# EAGLE design satellites_pcb_v2_0 (EAGLE 9.1.2)
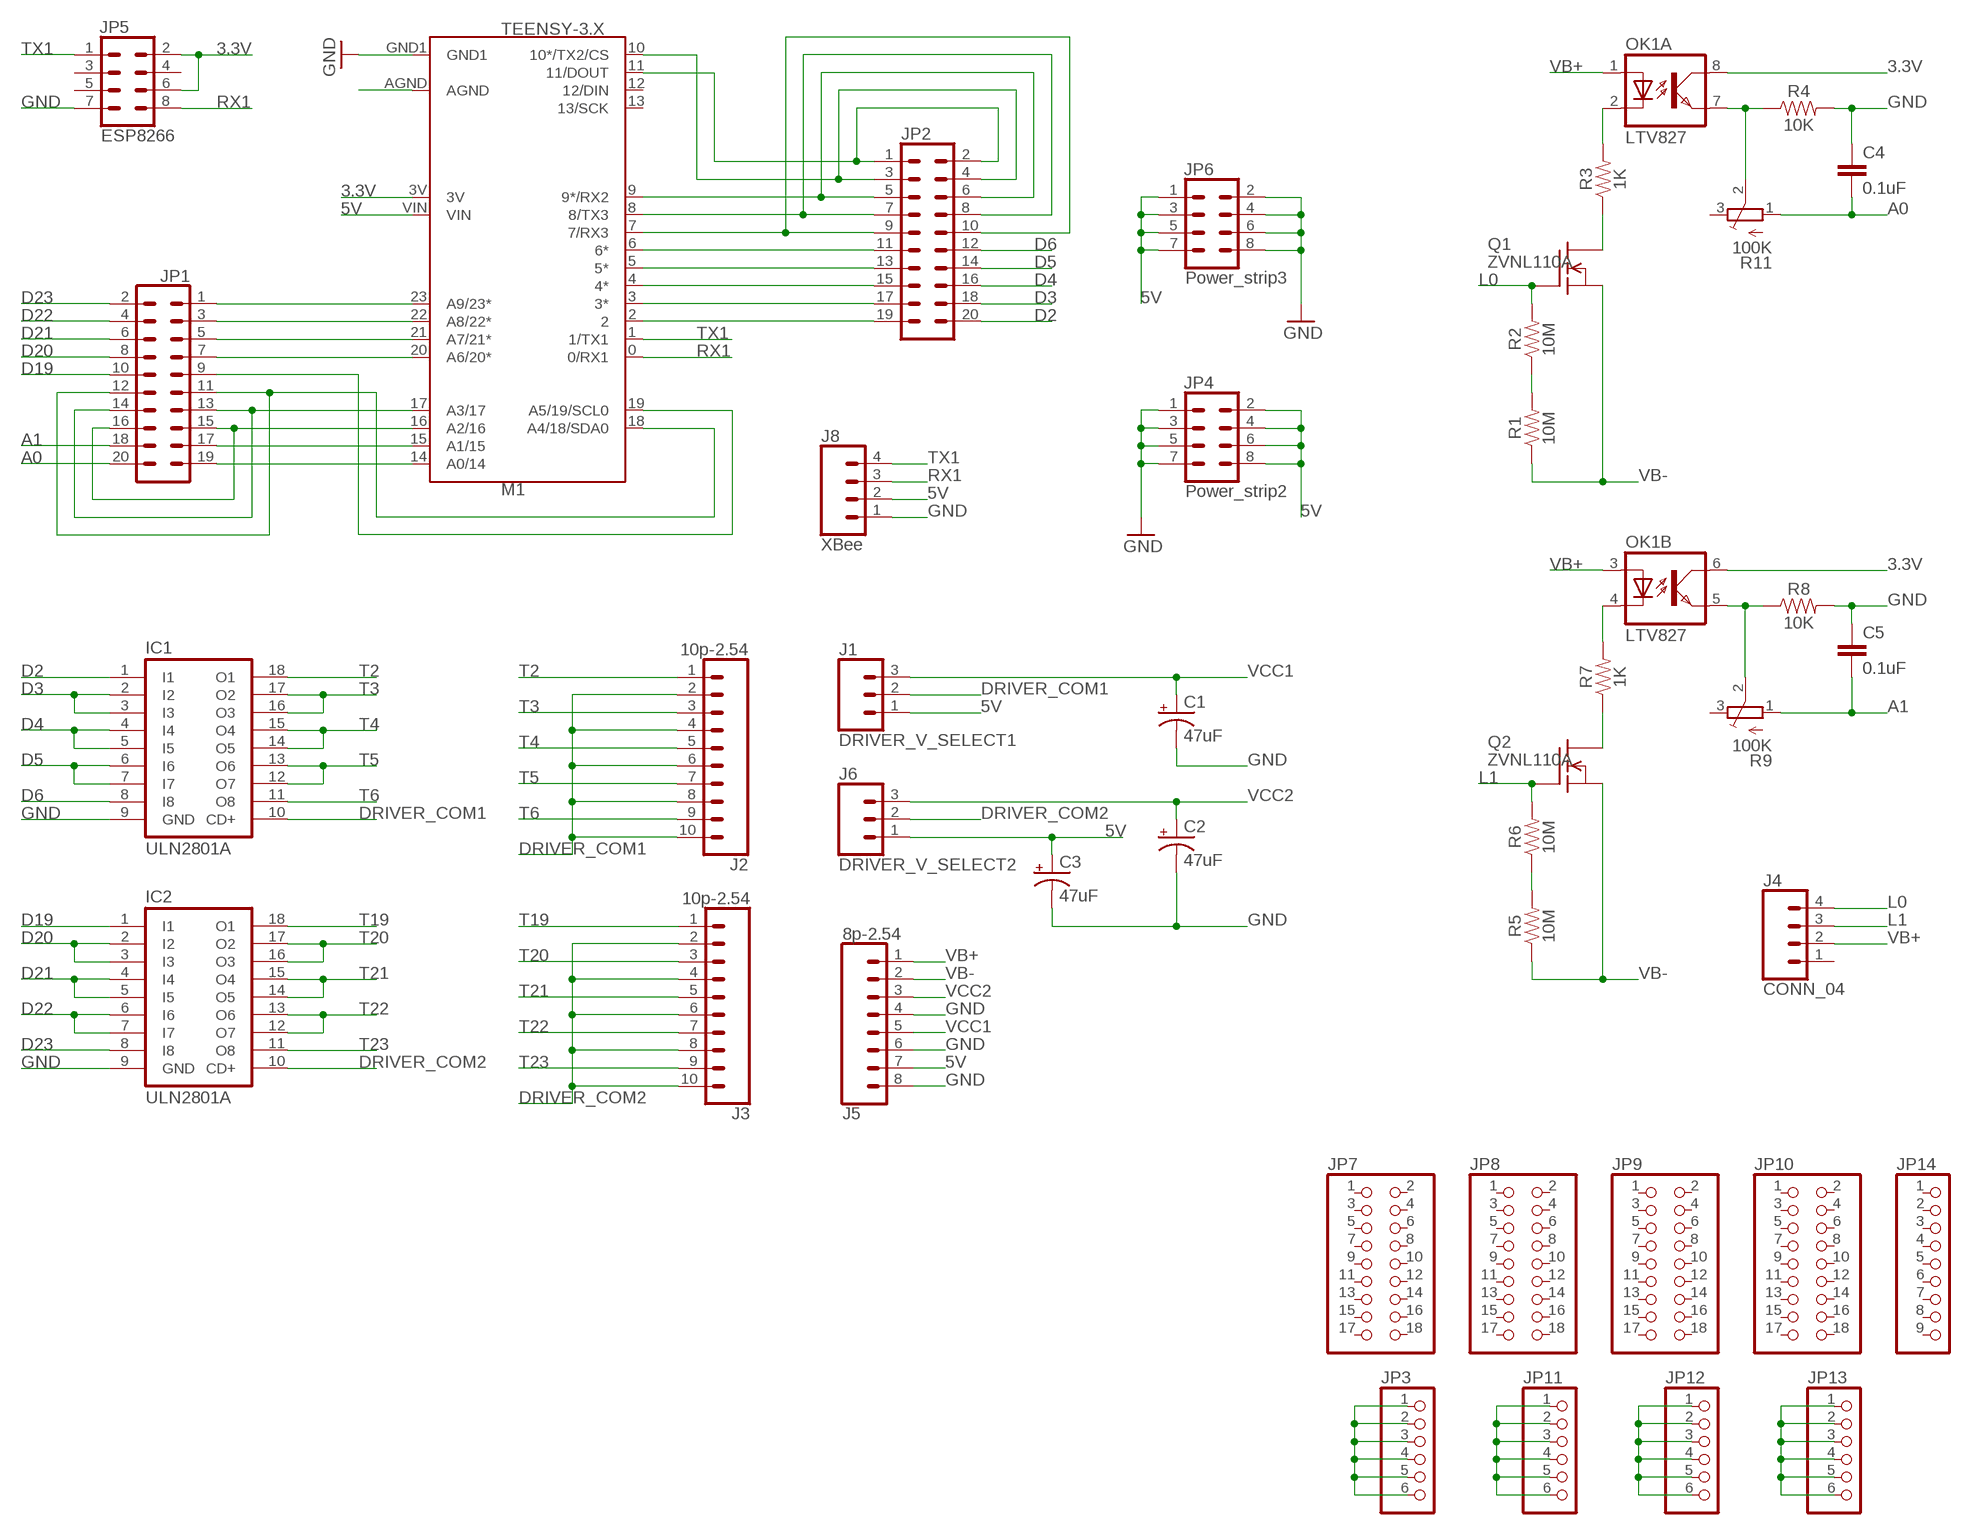
[diagram p0: schematic, sheet 1]

## Parts
C1  47uF  100UF-POLAR-RADIAL-2.5MM-25V-20%  [CPOL-RADIAL-2.5MM-6.5MM]
C2  47uF  100UF-POLAR-RADIAL-2.5MM-25V-20%  [CPOL-RADIAL-2.5MM-6.5MM]
C3  47uF  100UF-POLAR-RADIAL-2.5MM-25V-20%  [CPOL-RADIAL-2.5MM-6.5MM]
C4  0.1uF  22PF-PTH-2.54MM-200V-5%  [CAP-PTH-2.54]
C5  0.1uF  22PF-PTH-2.54MM-200V-5%  [CAP-PTH-2.54]
IC1  ULN2801A  [DIL18]
IC2  ULN2801A  [DIL18]
J1  DRIVER_V_SELECT1  CONN_03LOCK  [1X03_LOCK]
J2  10p-2.54  CONN_10  [SCREW_TERMINAL_10P_2.54MM_LONGPAD]
J3  10p-2.54  CONN_10  [SCREW_TERMINAL_10P_2.54MM_LONGPAD]
J4  CONN_04  [SCREW_TERMINAL_4P_2.54MM]
J5  8p-2.54  CONN_08SCREW_TERMINAL_8P_2.54MM_LONGPAD  [SCREW_TERMINAL_8P_2.54MM_LONGPAD]
J6  DRIVER_V_SELECT2  CONN_03LOCK  [1X03_LOCK]
J8  XBee  CONN_04LOCK  [1X04_LOCK]
JP1  CONN_10X2  [2X10]
JP2  CONN_10X2  [2X10]
JP3  PINHD-1X6CLEAN  [1X06-CLEAN]
JP4  Power_strip2  CONN_04X2  [2X4]
JP5  ESP8266  CONN_04X2  [2X4]
JP6  Power_strip3  CONN_04X2  [2X4]
JP7  PINHD-2X9-CBIG  [2X09-CLEANBIG]
JP8  PINHD-2X9-CBIG  [2X09-CLEANBIG]
JP9  PINHD-2X9-CBIG  [2X09-CLEANBIG]
JP10  PINHD-2X9-CBIG  [2X09-CLEANBIG]
JP11  PINHD-1X6CLEAN  [1X06-CLEAN]
JP12  PINHD-1X6CLEAN  [1X06-CLEAN]
JP13  PINHD-1X6CLEAN  [1X06-CLEAN]
JP14  PINHD-1X9  [1X09-BIG]
M1  TEENSY-3.X  TEENSY-3.1-TWO_ROWSNOSILK  [TEENSY-3.1_NOSILK]
OK1  LTV827  [DIP08]
Q1  ZVNL110A  [TO92]
Q2  ZVNL110A  [TO92]
R1  10M  RESISTORAXIAL-0.3  [AXIAL-0.3]
R2  10M  RESISTORAXIAL-0.3  [AXIAL-0.3]
R3  1K  RESISTORAXIAL-0.3  [AXIAL-0.3]
R4  10K  RESISTORAXIAL-0.3  [AXIAL-0.3]
R5  10M  RESISTORAXIAL-0.3  [AXIAL-0.3]
R6  10M  RESISTORAXIAL-0.3  [AXIAL-0.3]
R7  1K  RESISTORAXIAL-0.3  [AXIAL-0.3]
R8  10K  RESISTORAXIAL-0.3  [AXIAL-0.3]
R9  100K  TRIMPOT3386H  [TRIM-3386H]
R11  100K  TRIMPOT3386H  [TRIM-3386H]

## Nets
3.3V: JP5.2 JP5.6 M1.3V OK1.6(B:COL) OK1.8(A:COL)
5V [supply]: C3.1(+) J1.1 J5.7 J6.1 J8.2 JP4.2 JP4.4 JP4.6 JP4.8 JP6.1 JP6.3 JP6.5 JP6.7 M1.VIN
A0: C4.2 JP1.20 R11.1(A)
A1: C5.2 JP1.18 R9.1(A)
D2: IC1.1(I1) JP2.20
D3: IC1.2(I2) IC1.3(I3) JP2.18
D4: IC1.4(I4) IC1.5(I5) JP2.16
D5: IC1.6(I6) IC1.7(I7) JP2.14
D6: IC1.8(I8) JP2.12
D19: IC2.1(I1) JP1.10
D20: IC2.2(I2) IC2.3(I3) JP1.8
D21: IC2.4(I4) IC2.5(I5) JP1.6
D22: IC2.6(I6) IC2.7(I7) JP1.4
D23: IC2.8(I8) JP1.2
DRIVER_COM1 [supply]: IC1.10(CD+) J1.2 J2.2 J2.4 J2.6 J2.8 J2.10
DRIVER_COM2 [supply]: IC2.10(CD+) J3.2 J3.4 J3.6 J3.8 J3.10 J6.2
GND [supply]: C1.2(-) C2.2(-) C3.2(-) C4.1 C5.1 IC1.9(GND) IC2.9(GND) J5.4 J5.6 J5.8 J8.1 JP4.1 JP4.3 JP4.5 JP4.7 JP5.7 JP6.2 JP6.4 JP6.6 JP6.8 M1.GND1 R4.P$2 R8.P$2
L0: J4.4 Q1.2(G) R2.P$2
L1: J4.3 Q2.2(G) R6.P$2
N$1: JP1.1 M1.23(A9/23*)
N$2: JP1.3 M1.22(A8/22*)
N$3: JP2.5 JP2.6 M1.9(9*/RX2)
N$4: JP2.7 JP2.8 M1.8(8/TX3)
N$5: OK1.7(A:EMIT) R4.P$1 R11.2(S)
N$6: JP2.11 M1.6(6*)
N$7: JP2.13 M1.5(5*)
N$8: JP2.3 JP2.4 M1.10(10*/TX2/CS)
N$9: JP2.15 M1.4(4*)
N$10: JP1.5 M1.21(A7/21*)
N$11: JP1.7 M1.20(A6/20*)
N$12: OK1.5(B:EMIT) R8.P$1 R9.2(S)
N$13: Q1.1(D) R3.P$1
N$14: JP2.17 M1.3(3*)
N$15: R1.P$2 R2.P$1
N$16: JP2.19 M1.2
N$17: JP1.15 JP1.16 M1.16(A2/16)
N$18: JP1.17 M1.15(A1/15)
N$19: JP1.19 M1.14(A0/14)
N$20: JP1.11 JP1.12 M1.18(A4/18/SDA0)
N$21: JP1.9 M1.19(A5/19/SCL0)
N$22: OK1.2(A:C) R3.P$2
N$23: R5.P$2 R6.P$1
N$24: Q2.1(D) R7.P$1
N$25: OK1.4(B:C) R7.P$2
N$26 [supply]: JP3.1 JP3.2 JP3.3 JP3.4 JP3.5 JP3.6
N$27 [supply]: JP11.1 JP11.2 JP11.3 JP11.4 JP11.5 JP11.6
N$28 [supply]: JP12.1 JP12.2 JP12.3 JP12.4 JP12.5 JP12.6
N$29: JP2.9 JP2.10 M1.7(7/RX3)
N$30 [supply]: JP13.1 JP13.2 JP13.3 JP13.4 JP13.5 JP13.6
N$31: M1.AGND
N$32: JP1.13 JP1.14 M1.17(A3/17)
N$33: JP2.1 JP2.2 M1.11(11/DOUT)
RX1: J8.3 JP5.8 M1.0(0/RX1)
T2 [supply]: IC1.18(O1) J2.1
T3 [supply]: IC1.16(O3) IC1.17(O2) J2.3
T4 [supply]: IC1.14(O5) IC1.15(O4) J2.5
T5 [supply]: IC1.12(O7) IC1.13(O6) J2.7
T6 [supply]: IC1.11(O8) J2.9
T19 [supply]: IC2.18(O1) J3.1
T20 [supply]: IC2.16(O3) IC2.17(O2) J3.3
T21 [supply]: IC2.14(O5) IC2.15(O4) J3.5
T22 [supply]: IC2.12(O7) IC2.13(O6) J3.7
T23 [supply]: IC2.11(O8) J3.9
TX1: J8.4 JP5.1 M1.1(1/TX1)
VB+: J4.2 J5.1 OK1.1(A:A) OK1.3(B:A)
VB-: J5.2 Q1.3(S) Q2.3(S) R1.P$1 R5.P$1
VCC1 [supply]: C1.1(+) J1.3 J5.5
VCC2 [supply]: C2.1(+) J5.3 J6.3
Unconnected: J4.1 JP5.3 JP5.4 JP5.5 JP7.1 JP7.2 JP7.3 JP7.4 JP7.5 JP7.6 JP7.7 JP7.8 JP7.9 JP7.10 JP7.11 JP7.12 JP7.13 JP7.14 JP7.15 JP7.16 JP7.17 JP7.18 JP8.1 JP8.2 JP8.3 JP8.4 JP8.5 JP8.6 JP8.7 JP8.8 JP8.9 JP8.10 JP8.11 JP8.12 JP8.13 JP8.14 JP8.15 JP8.16 JP8.17 JP8.18 JP9.1 JP9.2 JP9.3 JP9.4 JP9.5 JP9.6 JP9.7 JP9.8 JP9.9 JP9.10 JP9.11 JP9.12 JP9.13 JP9.14 JP9.15 JP9.16 JP9.17 JP9.18 JP10.1 JP10.2 JP10.3 JP10.4 JP10.5 JP10.6 JP10.7 JP10.8 JP10.9 JP10.10 JP10.11 JP10.12 JP10.13 JP10.14 JP10.15 JP10.16 JP10.17 JP10.18 JP14.1 JP14.2 JP14.3 JP14.4 JP14.5 JP14.6 JP14.7 JP14.8 JP14.9 M1.12(12/DIN) M1.13(13/SCK) R9.3(E) R11.3(E)

## Library data of the parts
C1-C3 = SparkFun-Capacitors:100UF-POLAR: 100µF polarized capacitors A capacitor is a passive two-terminal electrical component used to store electrical energy temporarily in an electric field.; PROD_ID: CAP-08439; VALUE: 100uF
C4 C5 = SparkFun-Capacitors:22PF: 22pF ceramic capacitors A capacitor is a passive two-terminal electrical component used to store electrical energy temporarily in an electric field.; PROD_ID: CAP-09128; VALUE: 22pF
IC1 IC2 = uln-udn:ULN2801A: DRIVER ARRAY
J1 J6 = SparkFun-Connectors:CONN_03: Multi connection point. Often used as Generic Header-pin footprint for 0.1 inch spaced/style header connections On any of the 0.1 inch spaced packages, you can populate with these: Break Away Headers - Straight <https://www.sparkfun.com/products/116> (PRT-00116) Break Away Male Headers - Right Angle <https://www.sparkfun.com/products/553> (PRT-00553) Female Headers <https://www.sparkfun.com/products/115> (PRT-00115) Break Away Headers - Machine Pin <https://www.sparkfun.com/products/117> (PRT-00117) Break Away Female Headers - Swiss Machine Pin <https://www.sparkfun.com/products/743> (PRT-00743) Stackable Header - 3 Pin (Female, 0.1") <https://www.sparkfun.com/products/13875> (PRT-13875) For SCREWTERMINALS and SPRING TERMINALS visit here: Screw Terimnals on SparkFun.com <https://www.sparkfun.com/search/results?term=Screw+Terminals> (5mm/3.5mm/2.54mm spacing) This device is also useful as a general connection point to wire up your design to another part of your project. Our various solder wires solder well into these plated through hole pads. Hook-Up Wire - Assortment (Stranded, 22 AWG) <https://www.sparkfun.com/products/11375> (PRT-11375) Hook-Up Wire - Assortment (Solid Core, 22 AWG) <https://www.sparkfun.com/products/11367> (PRT-11367) View the entire wire category on our website here <https://www.sparkfun.com/categories/141> Special notes: Molex polarized connector foot print use with SKU : PRT-08232 with associated crimp pins and housings.
J2 J3 = ManyDev:CONN_10
J4 = ManyDev:CONN_04
J5 = ManyDev:CONN_08
J8 = SparkFun-Connectors:CONN_04: Multi connection point. Often used as Generic Header-pin footprint for 0.1 inch spaced/style header connections On any of the 0.1 inch spaced packages, you can populate with these: Break Away Headers - Straight <https://www.sparkfun.com/products/116> (PRT-00116) Break Away Male Headers - Right Angle <https://www.sparkfun.com/products/553> (PRT-00553) Female Headers <https://www.sparkfun.com/products/115> (PRT-00115) Break Away Headers - Machine Pin <https://www.sparkfun.com/products/117> (PRT-00117) Break Away Female Headers - Swiss Machine Pin <https://www.sparkfun.com/products/743> (PRT-00743) For SCREWTERMINALS and SPRING TERMINALS visit here: Screw Terimnals on SparkFun.com <https://www.sparkfun.com/search/results?term=Screw+Terminals> (5mm/3.5mm/2.54mm spacing) This device is also useful as a general connection point to wire up your design to another part of your project. Our various solder wires solder well into these plated through hole pads. Hook-Up Wire - Assortment (Stranded, 22 AWG) <https://www.sparkfun.com/products/11375> (PRT-11375) Hook-Up Wire - Assortment (Solid Core, 22 AWG) <https://www.sparkfun.com/products/11367> (PRT-11367) View the entire wire category on our website here <https://www.sparkfun.com/categories/141> Special notes: Molex polarized connector foot print use with SKU : PRT-08231 with associated crimp pins and housings. 1MM SMD Version SKU: PRT-10208; PROD_ID: CONN-09696
JP1 JP2 = SparkFun-Connectors:CONN_10X2: Multi connection point. Often used as Generic Header-pin footprint for 0.1 inch spaced/style header connections On any of the 0.1 inch spaced packages, you can populate with these: Break Away Headers - Straight <https://www.sparkfun.com/products/116> (PRT-00116) Break Away Male Headers - Right Angle <https://www.sparkfun.com/products/553> (PRT-00553) Female Headers <https://www.sparkfun.com/products/115> (PRT-00115) Break Away Headers - Machine Pin <https://www.sparkfun.com/products/117> (PRT-00117) Break Away Female Headers - Swiss Machine Pin <https://www.sparkfun.com/products/743> (PRT-00743) Special note about the "SPECIAL" package: This was SPECIALLY designed to be used with our Graphic LCD Backpack. Be sure you want to use this! It is not only staggered on each line of header holes, but IT IS ALSO offset of the center point of the top and bottom lines by 5 mil. This causes the headers to lock into place on the "standard" footprint on the LCD screen. The extra squares on the tdocu layer are there simply to reference other pins (if you were to actually populate a longer header than ten long - this is what we do with the backpacks).
JP3 JP11-JP13 = adafruit:PINHD-1X6: PIN HEADER
JP4-JP6 = SparkFun-Connectors:CONN_04X2: Multi connection point. Often used as Generic Header-pin footprint for 0.1 inch spaced/style header connections On any of the 0.1 inch spaced packages, you can populate with these: Break Away Headers - Straight <https://www.sparkfun.com/products/116> (PRT-00116) Break Away Male Headers - Right Angle <https://www.sparkfun.com/products/553> (PRT-00553) Female Headers <https://www.sparkfun.com/products/115> (PRT-00115) Break Away Headers - Machine Pin <https://www.sparkfun.com/products/117> (PRT-00117) Break Away Female Headers - Swiss Machine Pin <https://www.sparkfun.com/products/743> (PRT-00743)
JP7-JP10 = adafruit:PINHD-2X9: PIN HEADER With larger annulars
JP14 = ManyDev:PINHD-1X9: Pin header 1x10 0.1" spacing With round pins
M1 = ManyDev:TEENSY-3.1-TWO_ROWS: Teensy 3+ Footprint Mechanical footprint with connectors for Teensy Development Board with ARM Cortex. SparkFun Products: Teensy 3.2 <https://www.sparkfun.com/products/13736> Teensy LC <https://www.sparkfun.com/products/13305>; SF_ID: DEV-12646
OK1 = ManyDev:LTV827: SHARP OPTO COUPLER
Q1 Q2 = ManyDev:ZVNL110A: N-Channel Enhancement MOSFET not checked
R1-R8 = SparkFun-Resistors:RESISTOR: Generic Resistor Package
R9 R11 = ManyDev:TRIMPOT: SMT trimmer potentiometer part number TC33X http://www.ladyada.net/library/eagle

## Net classes
0 default: width 0.254 mm, clearance 0.254 mm
1 supply: width 0.508 mm, clearance 0.508 mm

## Board
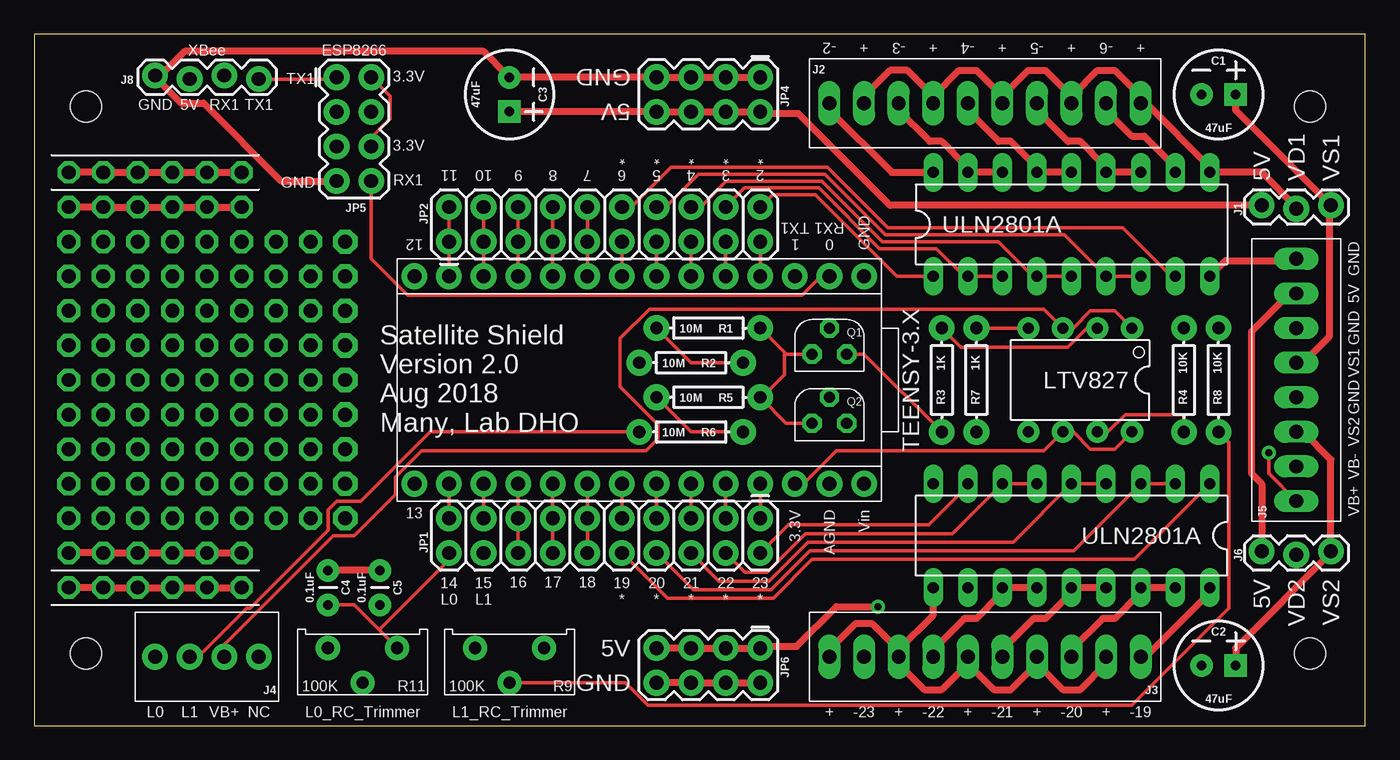
[diagram p1: board, top side]
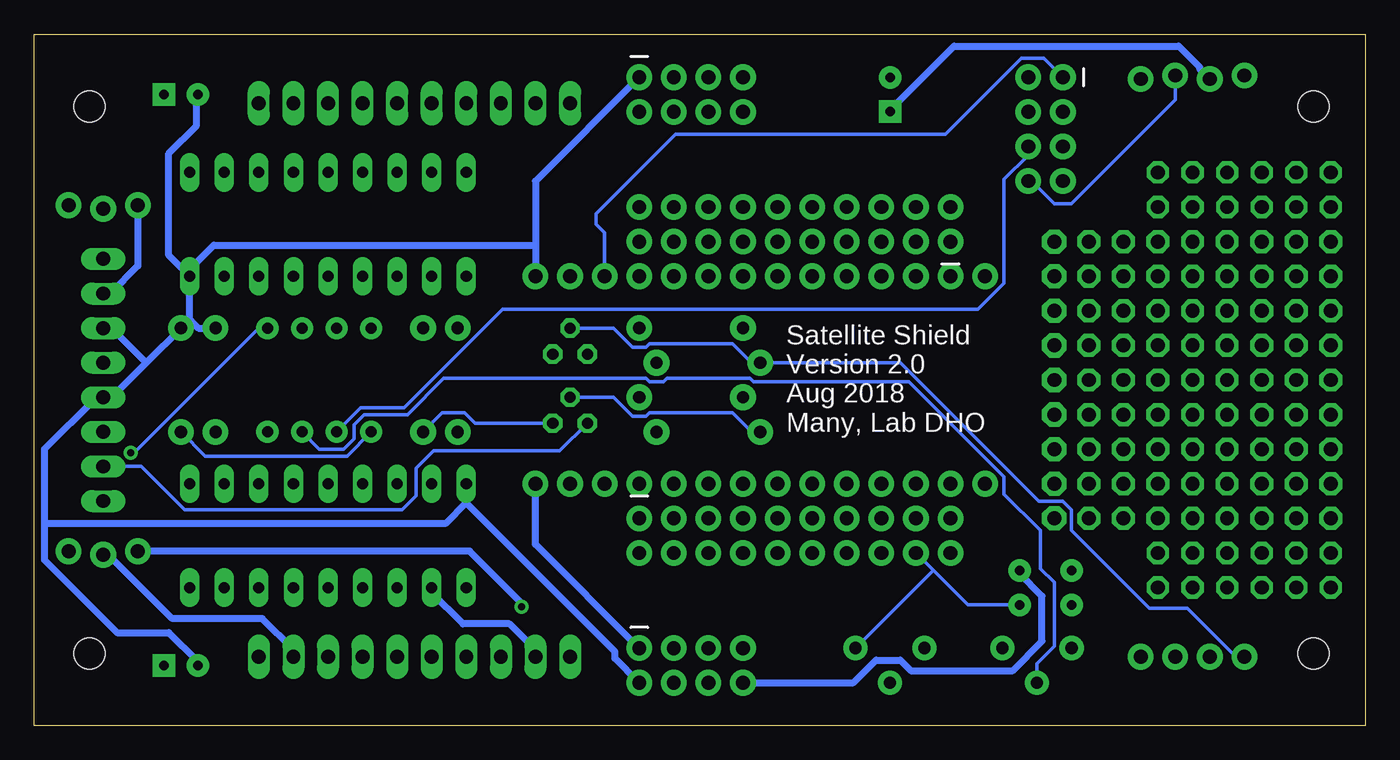
[diagram p2: board, bottom side, seen from below]

Size 97.79 x 50.8 mm. Coordinates in mm from the lower left corner, seen from the top.
Outline: 0,0 97.79,0 97.79,50.8 0,50.8 0,0
Copper layers (1*16): Top 0.035mm / dielectric 1.5mm / Bottom 0.035mm
Design rules "SparkFun": minimum track width 8mil, minimum drill 20mil, track to track 8mil, track to pad 8mil, pad to pad 8mil, via to via 8mil, smd to smd 8mil, copper to edge 10mil, drill to drill 8mil, minimum pad ring 12mil, minimum via ring 10mil, stop-mask expansion 4mil, vias tented up to drill 25mil, thermal gap 10mil
Holes 2.29 mm at 93.73,5.33 93.73,45.47 3.81,45.47 3.81,5.33

### Footprints (pad centres in the part's own frame; a part is rotated, then mirrored left to right if it is on the bottom)
CPOL-RADIAL-2.5MM-6.5MM = drill 0.7 pad 1.651 square: 1 1.25,0 | drill 0.7 pad 1.651: 2 -1.25,0
CAP-PTH-2.54 = drill 0.7 pad 1.651: 1 -1.27,0; 2 1.27,0
DIL18 = drill 0.813 long: 1 -10.16,-3.81; 2 -7.62,-3.81; 3 -5.08,-3.81; 4 -2.54,-3.81; 5 0,-3.81; 6 2.54,-3.81; 7 5.08,-3.81; 8 7.62,-3.81; 9 10.16,-3.81; 10 10.16,3.81; 11 7.62,3.81; 12 5.08,3.81; 13 2.54,3.81; 14 0,3.81; 15 -2.54,3.81; 16 -5.08,3.81; 17 -7.62,3.81; 18 -10.16,3.81
1X03_LOCK = drill 1.016 pad 1.88: 1 0,0.127; 2 2.54,-0.127; 3 5.08,0.127
SCREW_TERMINAL_10P_2.54MM_LONGPAD = drill 1.016 long: 1 0,0; 2 2.54,0; 3 5.08,0; 4 7.62,0; 5 10.16,0; 6 12.7,0; 7 15.24,0; 8 17.78,0; 9 20.32,0; 10 22.86,0
SCREW_TERMINAL_4P_2.54MM = drill 1.016 pad 1.88: 1 0,0; 2 2.54,0; 3 5.08,0; 4 7.62,0
SCREW_TERMINAL_8P_2.54MM_LONGPAD = drill 1.016 long: 1 0,0; 2 2.54,0; 3 5.08,0; 4 7.62,0; 5 10.16,0; 6 12.7,0; 7 15.24,0; 8 17.78,0
1X04_LOCK = drill 1.016 pad 1.88: 1 0,0.127; 2 2.54,-0.127; 3 5.08,0.127; 4 7.62,-0.127
2X10 = drill 1.016 pad 1.88: 1 0,0; 2 0,2.54; 3 2.54,0; 4 2.54,2.54; 5 5.08,0; 6 5.08,2.54; 7 7.62,0; 8 7.62,2.54; 9 10.16,0; 10 10.16,2.54; 11 12.7,0; 12 12.7,2.54; 13 15.24,0; 14 15.24,2.54; 15 17.78,0; 16 17.78,2.54; 17 20.32,0; 18 20.32,2.54; 19 22.86,0; 20 22.86,2.54
1X06-CLEAN = drill 1.016 octagon: 1 -6.35,0; 2 -3.81,0; 3 -1.27,0; 4 1.27,0; 5 3.81,0; 6 6.35,0
2X4 = drill 1.016 pad 1.88: 1 -3.81,-1.27; 2 -3.81,1.27; 3 -1.27,-1.27; 4 -1.27,1.27; 5 1.27,-1.27; 6 1.27,1.27; 7 3.81,-1.27; 8 3.81,1.27
2X09-CLEANBIG = drill 1.016 pad 1.676 octagon: 1 -10.16,-1.27; 2 -10.16,1.27; 3 -7.62,-1.27; 4 -7.62,1.27; 5 -5.08,-1.27; 6 -5.08,1.27; 7 -2.54,-1.27; 8 -2.54,1.27; 9 0,-1.27; 10 0,1.27; 11 2.54,-1.27; 12 2.54,1.27; 13 5.08,-1.27; 14 5.08,1.27; 15 7.62,-1.27; 16 7.62,1.27; 17 10.16,-1.27; 18 10.16,1.27
1X09-BIG = drill 1.016 pad 1.778 octagon: 1 -10.16,0; 2 -7.62,0; 3 -5.08,0; 4 -2.54,0; 5 0,0; 6 2.54,0; 7 5.08,0; 8 7.62,0; 9 10.16,0
TEENSY-3.1_NOSILK = drill 1.016 pad 1.88: 0 7.62,-13.97; 1 7.62,-11.43; 2 7.62,-8.89; 3 7.62,-6.35; 3V -7.62,-11.43; 4 7.62,-3.81; 5 7.62,-1.27; 6 7.62,1.27; 7 7.62,3.81; 8 7.62,6.35; 9 7.62,8.89; 10 7.62,11.43; 11 7.62,13.97; 12 7.62,16.51; 13 -7.62,16.51; 14 -7.62,13.97; 15 -7.62,11.43; 16 -7.62,8.89; 17 -7.62,6.35; 18 -7.62,3.81; 19 -7.62,1.27; 20 -7.62,-1.27; 21 -7.62,-3.81; 22 -7.62,-6.35; 23 -7.62,-8.89; AGND -7.62,-13.97; GND1 7.62,-16.51; VIN -7.62,-16.51
DIP08 = drill 0.813 pad 1.626: 1 -3.81,-3.81; 2 -1.27,-3.81; 3 1.27,-3.81; 4 3.81,-3.81; 5 3.81,3.81; 6 1.27,3.81; 7 -1.27,3.81; 8 -3.81,3.81
TO92 = drill 0.813 octagon: 1 1.27,0; 2 0,1.905; 3 -1.27,0
AXIAL-0.3 = drill 0.9 pad 1.88: P$1 -3.81,0; P$2 3.81,0
TRIM-3386H = drill 0.9 pad 1.778: 1 -2.54,-2.54; 2 0,0; 3 2.54,-2.54

### Placement (x,y rotation side)
C1  87,46.35 0 top
C2  87,4.45 0 top
C3  34.92,46.35 270 top
C4  21.59,10.16 270 top
C5  25.4,10.16 270 top
IC1  76.2,36.83 0 top
IC2  76.2,13.97 180 top
J1  90.17,38.1 0 top
J2  58.42,45.72 0 top
J3  81.28,5.08 180 top
J4  16.51,5.08 180 top
J5  92.71,16.51 90 top
J6  90.17,12.7 0 top
J8  8.89,47.62 0 top
JP1  53.34,15.24 180 top
JP2  30.48,35.56 0 top
JP3  8.89,38.1 0 top
JP4  49.53,46.35 180 top
JP5  23.5,43.81 270 top
JP6  49.53,4.45 180 top
JP7  19.05,25.4 90 top
JP8  13.97,25.4 90 top
JP9  8.89,25.4 90 top
JP10  3.81,25.4 90 top
JP11  8.89,40.64 0 top
JP12  8.89,12.7 0 top
JP13  8.89,10.16 0 top
JP14  22.86,25.4 90 top
M1  44.45,25.4 90 top
OK1  76.83,25.4 180 top
Q1  58.42,27.3 0 top
Q2  58.42,22.23 0 top
R1  49.53,29.21 180 top
R2  48.26,26.67 180 top
R3  66.67,25.4 90 top
R4  84.45,25.4 90 top
R5  49.53,24.13 180 top
R6  48.26,21.59 180 top
R7  69.22,25.4 90 top
R8  87,25.4 90 top
R9  34.92,3.17 180 top
R11  24.13,3.17 180 top

### Tracks (layer width: path | path; a pad name or v marks a point on that pad's centre or on a via)
3.3V
  Top 0.254: JP5.6 24.77,43.18 26.16,44.58 26.16,46.23 JP5.2 | OK1.8 79.38,20.32 77.6,20.32 76.33,21.59 OK1.6 74.17,20.19 58.93,20.19 56.52,17.78 M1.3V
  Bottom 0.254: JP5.6 24.77,41.91 26.54,40.13 26.54,32.51 28.45,30.61 63.37,30.61 70.61,23.37 73.79,23.37 OK1.6
5V  (via drill 0.51)
  Top 0.508: C3.1 34.92,45.09 JP4.8 45.85,45.09 JP4.6 48.39,45.09 JP4.4 50.93,45.09 JP4.2 53.47,44.96 56.13,44.96 62.87,38.23 J1.1 | J6.1 90.17,17.78 89.41,18.54 89.41,28.96 92.2,31.75 J5.7 | JP6.7 JP6.5 48.39,5.71 JP6.3 50.93,5.71 JP6.1 53.47,5.84 56.01,5.84 58.93,8.76 v61.98,8.76
  Bottom 0.508: J8.2 12.19,48.26 12.19,48.39 13.72,49.91 30.23,49.91 34.92,45.21 C3.1 | J5.7 92.2,31.75 90.17,33.78 J1.1 | M1.VIN 60.96,13.34 JP6.1 | J6.1 65.79,12.83 61.98,9.02 v61.98,8.76
A0
  Top 0.254: C4.2 23.5,8.89 25.34,7.05 | R11.1 25.34,7.05 | JP1.20 30.48,12.19 25.34,7.05
A1
  Bottom 0.254: C5.2 29.21,8.89 31.75,11.43 | JP1.18 31.75,11.43 | 31.75,11.43 R9.1
D2
  Top 0.254: IC1.1 63.37,33.02 57.4,38.99 54.23,38.99 JP2.20
D3
  Top 0.254: IC1.3 IC1.2 68.33,33.02 66.29,35.05 62.1,35.05 57.66,39.5 52.2,39.5 JP2.18
D4
  Top 0.254: IC1.5 IC1.4 73.38,33.02 70.84,35.56 62.31,35.56 57.87,40.01 50.84,40.01 48.93,38.1 JP2.16
D5
  Top 0.254: IC1.7 IC1.6 75.69,36.07 62.52,36.07 58.08,40.51 48.8,40.51 46.39,38.1 JP2.14
D6
  Top 0.254: JP2.12 43.85,38.1 46.77,41.02 58.29,41.02 62.73,36.58 79.98,36.58 83.54,33.02 IC1.8
D19
  Top 0.254: IC2.1 80.8,12.22 57.15,12.22 54.29,9.37 46.51,9.37 JP1.10
D20
  Top 0.254: IC2.2 IC2.3 76.36,12.86 56.99,12.86 54.13,10 48.42,10 JP1.8
D21
  Top 0.254: IC2.4 IC2.5 71.91,13.49 56.83,13.49 53.98,10.64 50.32,10.64 JP1.6
D22
  Top 0.254: IC2.6 IC2.7 67.47,14.13 56.67,14.13 53.82,11.27 52.23,11.27 JP1.4
D23
  Top 0.254: JP1.2 55.4,14.76 65.72,14.76 68.58,17.62 IC2.8
DRIVER_COM1
  Top 0.508: J1.2 92.71,38.1 90.17,40.64 IC1.10 86.23,40.77 86.23,41.15 81.79,45.59 81.41,45.59 J2.10 81.28,46.23 79.38,48.13 78.11,48.13 76.33,46.35 J2.8 76.2,46.23 74.3,48.13 73.03,48.13 71.25,46.35 J2.6 71.12,46.23 69.22,48.13 67.94,48.13 66.17,46.35 J2.4 66.04,46.23 64.14,48.13 62.87,48.13 60.96,46.23 J2.2
DRIVER_COM2
  Top 0.508: IC2.10 66.04,8.13 63.5,5.59 J3.8 | J3.10 58.42,5.59 60.33,7.49 61.59,7.49 63.37,5.71 J3.8 | J3.8 63.5,4.83 63.5,4.57 65.41,2.67 66.67,2.67 68.58,4.57 J3.6 68.71,4.45 70.48,2.67 71.75,2.67 73.66,4.57 J3.4 73.79,4.45 75.56,2.67 76.83,2.67 78.74,4.57 J3.2
  Bottom 0.508: J6.2 92.33,12.57 87.63,7.87 81.03,7.87 78.74,5.59 J3.2
GND
  Top 0.508: JP5.7 18.16,40.01 12.45,45.72 10.79,45.72 8.89,47.62 J8.1 9.14,47.62 11.05,49.53 33.02,49.53 34.8,47.75 C3.2 34.92,47.62 JP4.7 JP4.5 JP4.3 JP4.1 | IC1.9 87.5,34.16 92.08,34.16 J5.8 | C5.1 C4.1 | JP6.8 JP6.6 JP6.4 JP6.2
  Bottom 0.508: 60.96,35.31 60.96,40.01 JP4.1 | 60.96,35.31 M1.GND1 | IC1.9 87.88,34.54 87.88,42.04 85.85,44.07 85.85,46.35 C1.2 | 60.96,35.31 84.58,35.31 86.49,33.4 IC1.9 | R8.P$2 89.53,26.67 | 89.53,26.67 92.08,24.13 J5.4 92.84,24 93.34,24 97.03,20.32 97.03,14.86 | J5.6 92.08,29.21 89.53,26.67 | IC1.9 86.36,29.84 R8.P$2 | 97.03,14.86 97.03,12.19 91.69,6.86 87.88,6.86 85.85,4.83 85.85,4.45 C2.2 | R4.P$2 85.72,29.21 86.23,29.72 R8.P$2 | 66.04,16.38 IC2.9 | 66.04,16.38 55.12,5.46 55.12,4.95 JP6.2 | C5.1 25.4,11.18 23.75,9.53 23.75,6.22 25.91,4.06 33.4,4.06 34.16,4.83 35.94,4.83 37.59,3.17 JP6.8 | 97.03,14.86 67.56,14.86 66.04,16.38
L0
  Bottom 0.254: Q1.2 55.24,29.21 53.85,27.81 52.83,27.81 52.58,28.07 46.48,28.07 45.09,26.67 R2.P$2 34.16,26.67 24,16.51 22.23,16.51 21.59,15.88 21.59,14.35 15.88,8.64 13.08,8.64 9.53,5.08 J4.4
L1
  Top 0.254: J4.3 12.06,5.08 15.62,8.64 15.88,8.64 21.59,14.35 21.59,15.88 22.23,16.51 24,16.51 29.08,21.59 R6.P$2
  Bottom 0.254: Q2.2 55.24,24.13 53.85,22.73 52.83,22.73 52.58,22.99 46.48,22.99 45.09,21.59 R6.P$2
N$1
  Top 0.254: M1.23 JP1.1
N$2
  Top 0.254: M1.22 JP1.3
N$3
  Top 0.254: M1.9 JP2.5 JP2.6
N$4
  Top 0.254: M1.8 JP2.7 JP2.8
N$5
  Top 0.254: R4.P$1 84.45,22.73 84.33,22.86 80.14,22.86 78.87,21.59 OK1.7
  Bottom 0.254: R11.2 24.13,4.57 22.86,5.84 22.86,10.54 23.88,11.56 23.88,14.35 26.54,17.02 26.54,18.29 33.53,25.27 44.96,25.27 45.21,25.53 51.31,25.53 51.56,25.27 52.58,25.27 52.83,25.53 67.69,25.53 70.36,22.86 73.53,22.86 74.3,22.1 74.3,21.08 75.06,20.32 76.83,20.32 OK1.7
N$6
  Top 0.254: JP2.11 M1.6
N$7
  Top 0.254: JP2.13 M1.5
N$8
  Top 0.254: M1.10 JP2.3 JP2.4
N$9
  Top 0.254: JP2.15 M1.4
N$10
  Top 0.254: M1.21 JP1.5
N$11
  Top 0.254: M1.20 JP1.7
N$12
  Top 0.254: R9.2 43.43,3.17 45.09,1.52 80.64,1.52 87.76,8.64 87.76,20.83 R8.P$1
  Bottom 0.254: OK1.5 74.8,19.81 85.22,19.81 R8.P$1
N$13
  Top 0.254: Q1.1 60.96,27.3 R3.P$1
N$14
  Top 0.254: JP2.17 M1.3
N$15
  Top 0.254: R2.P$1 48.26,26.67 R1.P$2
N$16
  Top 0.254: JP2.19 M1.2
N$17
  Top 0.254: JP1.16 JP1.15 M1.16
N$18
  Top 0.254: M1.15 JP1.17
N$19
  Top 0.254: M1.14 JP1.19
N$20
  Top 0.254: JP1.12 JP1.11 M1.18
N$21
  Top 0.254: M1.19 JP1.9
N$22
  Top 0.254: OK1.2 77.34,29.21 75.95,27.81 68.07,27.81 R3.P$2
N$23
  Top 0.254: R6.P$1 48.26,21.59 R5.P$2
N$24
  Bottom 0.254: Q2.1 65.41,22.23 66.17,22.99 67.82,22.99 R7.P$1
N$25
  Top 0.254: R7.P$2 OK1.4
N$26
  Top 0.508: JP3.1 JP3.2 5.21,38.1 JP3.3 7.75,38.1 JP3.4 10.29,38.1 JP3.5 12.83,38.1 JP3.6
N$27
  Top 0.508: JP11.1 JP11.2 5.21,40.64 JP11.3 7.75,40.64 JP11.4 10.29,40.64 JP11.5 12.83,40.64 JP11.6
N$28
  Top 0.508: JP12.1 JP12.2 5.21,12.7 JP12.3 7.75,12.7 JP12.4 10.29,12.7 JP12.5 12.83,12.7 JP12.6
N$29
  Top 0.254: M1.7 JP2.9 JP2.10
N$30
  Top 0.508: JP13.1 JP13.2 5.21,10.16 JP13.3 7.75,10.16 JP13.4 10.29,10.16 JP13.5 12.83,10.16 JP13.6
N$32
  Top 0.254: JP1.14 JP1.13 M1.17
N$33
  Top 0.254: M1.11 JP2.1 JP2.2
RX1
  Top 0.254: M1.0 57.78,33.02 56.39,31.62 27.43,31.62 24.77,34.29 JP5.8
  Bottom 0.254: JP5.8 24.51,40.01 22.86,38.35 21.59,38.35 13.97,45.97 J8.3
T2
  Top 0.508: IC1.18 62.99,40.64 58.42,45.21 J2.1
T3
  Top 0.508: IC1.16 IC1.17 68.45,40.77 68.45,41.15 66.67,42.93 65.79,42.93 63.5,45.21 J2.3
T4
  Top 0.508: IC1.14 IC1.15 73.53,40.77 73.53,41.15 71.75,42.93 70.87,42.93 68.58,45.21 J2.5
T5
  Top 0.508: IC1.12 IC1.13 78.61,40.77 78.61,41.15 76.83,42.93 75.95,42.93 73.66,45.21 J2.7
T6
  Top 0.508: IC1.11 83.82,41.02 81.53,43.31 80.64,43.31 78.74,45.21 J2.9
T19
  Top 0.508: IC2.18 86.36,9.78 81.66,5.08 J3.1
T20
  Top 0.508: IC2.17 IC2.16 81.15,10.03 81.15,9.65 79.38,7.87 78.49,7.87 76.2,5.59 J3.3
T21
  Top 0.508: IC2.15 IC2.14 76.07,10.03 76.07,9.65 74.3,7.87 73.41,7.87 71.12,5.59 J3.5
T22
  Top 0.508: IC2.13 IC2.12 70.99,10.03 70.99,9.65 69.22,7.87 68.33,7.87 66.04,5.59 J3.7
T23
  Bottom 0.508: IC2.11 68.58,9.78 66.29,7.49 62.87,7.49 60.96,5.59 J3.9
TX1
  Top 0.254: J8.4 22.1,47.5 JP5.1
  Bottom 0.254: M1.1 55.88,36.2 56.52,36.83 56.52,37.59 50.67,43.43 30.86,43.43 25.27,49.02 23.62,49.02 JP5.1
VB+  (via drill 0.51)
  Top 0.254: OK1.1 79.38,30.48 77.6,30.48 76.33,29.21 OK1.3 74.17,30.61 45.21,30.61 43.05,28.45 43.05,24.89 45.85,22.1 45.85,21.08 44.96,20.19 28.45,20.19 26.54,18.29 26.54,17.02 23.5,13.97 21.97,13.97 13.97,5.97 J4.2 | J5.1 90.68,18.54 v90.68,20.07
  Bottom 0.254: v90.68,20.07 90.42,20.07 81.28,29.21 OK1.1
VB-
  Top 0.254: Q1.3 55.24,27.3 55.18,27.37 | R1.P$1 55.18,27.37 | Q2.3 55.24,22.23 R5.P$1 53.47,24.13 55.12,25.78 55.12,27.3 55.18,27.37
  Bottom 0.254: J5.2 89.92,19.05 86.74,15.88 70.74,15.88 69.72,16.89 69.72,18.92 68.45,20.19 59.18,20.19 Q2.3
VCC1
  Top 0.508: C1.1 88.27,46.35 88.27,45.21 95.12,38.35 J1.3 95.12,38.1 95.12,28.57 93.22,26.67 J5.5
VCC2
  Top 0.508: J5.3 93.22,21.59 95.25,19.56 J6.3 95.25,12.7 88.27,5.71 88.27,4.45 C2.1

### Text on the board
tPlace: -2 | + | -3 | + | -4 | + | -5 | + | -6 | + | TX1 | GND | 3.3V | GND | 5V | RX1 | TX1 | 5V | 3.3V | GND | RX1 | 11 | 10 | 9 | 8 | 7 | 6 / * | 5 / * | 4 / * | 3 / * | 2 / * | 5V | VD1 | VS1 | 12 | 1 / TX1 | 0 / RX1 | GND | GND | 5V | GND | VS1 | GND | Satellite Shield / Version 2.0 / Aug 2018 / Many, Lab DHO | VS2 | VB- | VB+ | 3.3V | AGND | Vin | 13 | 5V | VD2 | VS2 | 16 | 17 | 18 | 14 / L0 | 15 / L1 | 19 / * | 20 / * | 21 / * | 22 / * | 23 / * | 5V | GND | L0 | L1 | VB+ | NC | L0_RC_Trimmer | L1_RC_Trimmer | + | -23 | + | -22 | + | -21 | + | -20 | + | -19
bPlace: Satellite Shield / Version 2.0 / Aug 2018 / Many, Lab DHO